# EAGLE design uplink (EAGLE 8.6.3)
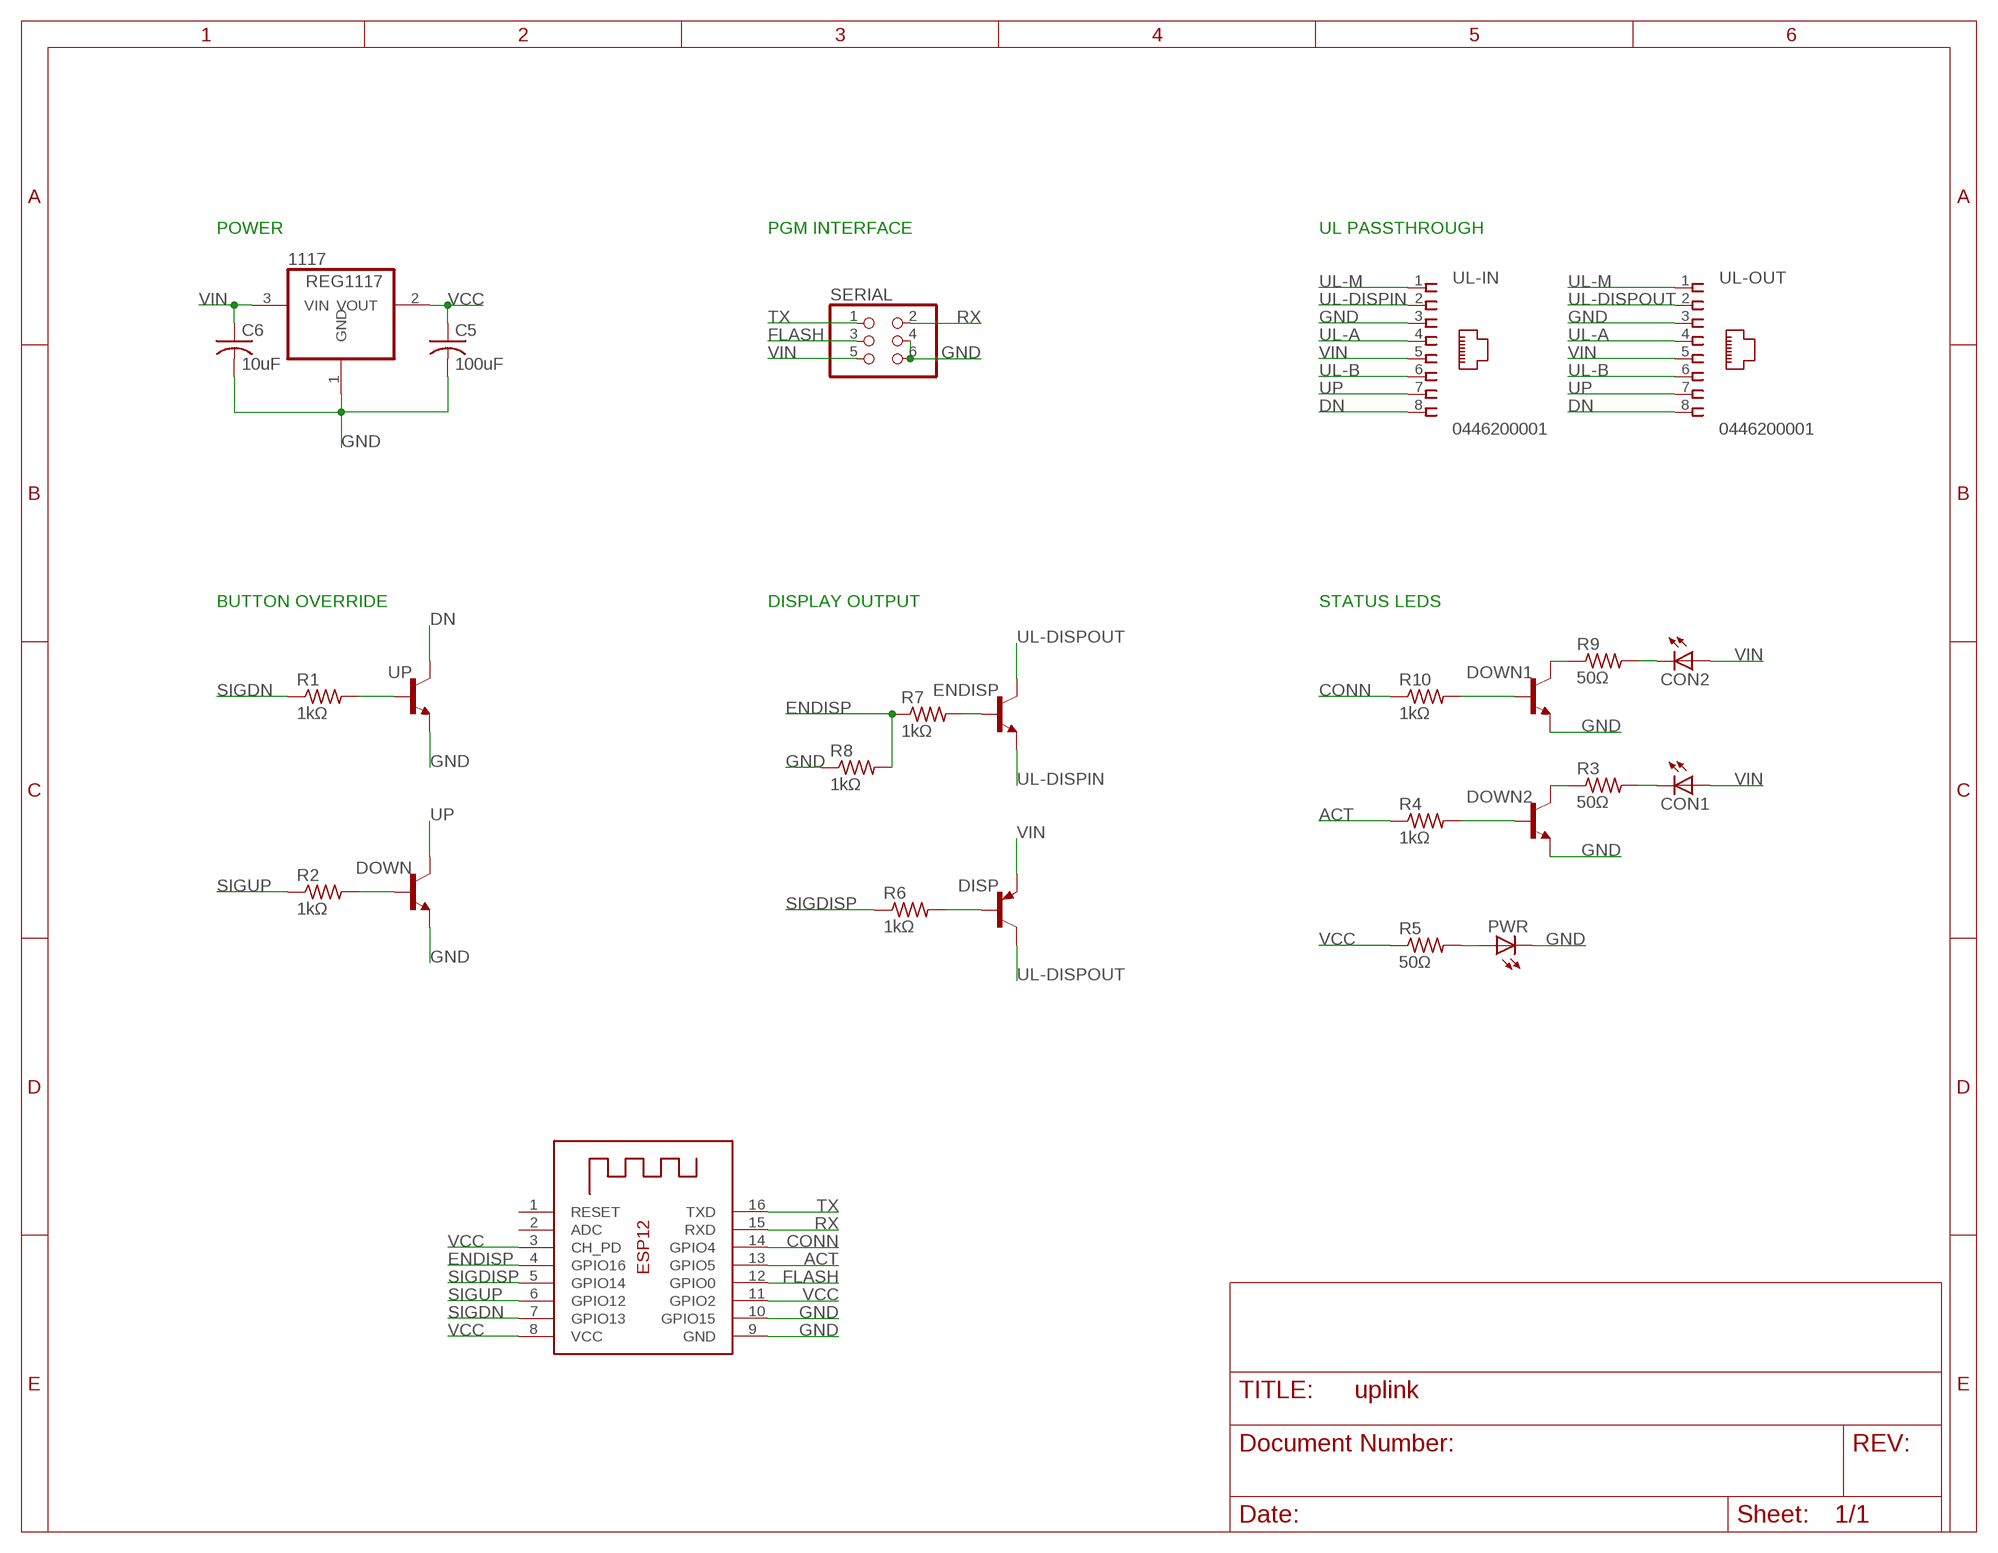
[diagram p0: schematic, sheet 1]

## Parts
1117  REG1117  [SOT223]
C5  100uF  C-USC0805  [C0805]
C6  10uF  C-USC0805  [C0805]
CON1  LEDCHIPLED_0805  [CHIPLED_0805]
CON2  LEDCHIPLED_0805  [CHIPLED_0805]
DISP  MMBT3906LT1SMD  [SOT23-BEC]
DOWN  MMBT3904LT1-NPN-SOT23-BEC  [SOT23-BEC]
DOWN1  MMBT3904LT1-NPN-SOT23-BEC  [SOT23-BEC]
DOWN2  MMBT3904LT1-NPN-SOT23-BEC  [SOT23-BEC]
ENDISP  MMBT3904LT1-NPN-SOT23-BEC  [SOT23-BEC]
ESP12  ESP-12  [ESP-12]
PWR  LEDCHIPLED_0805  [CHIPLED_0805]
R1  1kΩ  R-US_M0805  [M0805]
R2  1kΩ  R-US_M0805  [M0805]
R3  50Ω  R-US_M0805  [M0805]
R4  1kΩ  R-US_M0805  [M0805]
R5  50Ω  R-US_M0805  [M0805]
R6  1kΩ  R-US_M0805  [M0805]
R7  1kΩ  R-US_M0805  [M0805]
R8  1kΩ  R-US_M0805  [M0805]
R9  50Ω  R-US_M0805  [M0805]
R10  1kΩ  R-US_M0805  [M0805]
SERIAL  PINHD-2X3  [2X03]
UL-IN  0446200001  [0446200001]
UL-OUT  0446200001  [0446200001]
UP  MMBT3904LT1-NPN-SOT23-BEC  [SOT23-BEC]

## Nets
ACT: ESP12.13(GPIO5) R4.1
CONN: ESP12.14(GPIO4) R10.1
DN: UL-IN.8 UL-OUT.8 UP.C
ENDISP: ESP12.4(GPIO16) R7.1 R8.2
FLASH: ESP12.12(GPIO0) SERIAL.3
GND: 1117.1(GND) C5.2 C6.2 DOWN1.E DOWN2.E DOWN.E ESP12.9(GND) ESP12.10(GPIO15) PWR.C R8.1 SERIAL.4 SERIAL.6 UL-IN.3 UL-OUT.3 UP.E
N$1: R1.2 UP.B
N$2: DOWN.B R2.2
N$3: DISP.B R6.2
N$4: ENDISP.B R7.2
N$5: CON2.C R9.2
N$6: DOWN1.C R9.1
N$7: DOWN1.B R10.2
N$8: PWR.A R5.2
N$9: DOWN2.C R3.1
N$10: DOWN2.B R4.2
N$11: CON1.C R3.2
RX: ESP12.15(RXD) SERIAL.2
SIGDISP: ESP12.5(GPIO14) R6.1
SIGDN: ESP12.7(GPIO13) R1.1
SIGUP: ESP12.6(GPIO12) R2.1
TX: ESP12.16(TXD) SERIAL.1
UL-A: UL-IN.4 UL-OUT.4
UL-B: UL-IN.6 UL-OUT.6
UL-DISPIN: ENDISP.E UL-IN.2
UL-DISPOUT: DISP.C ENDISP.C UL-OUT.2
UL-M: UL-IN.1 UL-OUT.1
UP: DOWN.C UL-IN.7 UL-OUT.7
VCC: 1117.2(VOUT) C5.1 ESP12.3(CH_PD) ESP12.8(VCC) ESP12.11(GPIO2) R5.1
VIN: 1117.3(VIN) C6.1 CON1.A CON2.A DISP.E SERIAL.5 UL-IN.5 UL-OUT.5
Unconnected: ESP12.1(RESET) ESP12.2(ADC)

## Notes on the sheet
- POWER | PGM INTERFACE | UL PASSTHROUGH
- BUTTON OVERRIDE | DISPLAY OUTPUT | STATUS LEDS

## Library data of the parts
1117 = burr-brown:REG1117: 800mA and 1A Low Dropout (LDO) Positive Regulator 1.8V, 2.5V, 2.85V, 3.3V, 5V, and Adj; MPN: REG1117; OC_FARNELL: 1097566; OC_NEWARK: 14P6981
C5 C6 = rcl:C-US: CAPACITOR, American symbol; SPICEPREFIX: C
CON1 CON2 PWR = adafruit:LED: LED OSRAM: - CHIPLED LG R971, LG N971, LY N971, LG Q971, LY Q971, LO R971, LY R971 LH N974, LH R974 LS Q976, LO Q976, LY Q976 LO Q996 - Hyper CHIPLED LW Q18S LB Q993, LB Q99A, LB R99A - SideLED LS A670, LO A670, LY A670, LG A670, LP A670 LB A673, LV A673, LT A673, LW A673 LH A674 LY A675 LS A676, LA A676, LO A676, LY A676, LW A676 LS A679, LY A679, LG A679 - Hyper Micro SIDELED® LS Y876, LA Y876, LO Y876, LY Y876 LT Y87S - SmartLED LW L88C, LW L88S LB L89C, LB L89S, LG L890 LS L89K, LO L89K, LY L89K LS L896, LA L896, LO L896, LY L896 - TOPLED LS T670, LO T670, LY T670, LG T670, LP T670 LSG T670, LSP T670, LSY T670, LOP T670, LYG T670 LG T671, LOG T671, LSG T671 LB T673, LV T673, LT T673, LW T673 LH T674 LS T676, LA T676, LO T676, LY T676, LB T676, LH T676, LSB T676, LW T676 LB T67C, LV T67C, LT T67C, LS T67K, LO T67K, LY T67K, LW E67C LS E67B, LA E67B, LO E67B, LY E67B, LB E67C, LV E67C, LT E67C LW T67C LS T679, LY T679, LG T679 LS T770, LO T770, LY T770, LG T770, LP T770 LB T773, LV T773, LT T773, LW T773 LH T774 LS E675, LA E675, LY E675, LS T675 LS T776, LA T776, LO T776, LY T776, LB T776 LHGB T686 LT T68C, LB T68C - Hyper Mini TOPLED® LB M676 - Mini TOPLED Santana® LG M470 LS M47K, LO M47K, LY M47K Source: http://www.osram.convergy.de/
DISP = transistor-pnp:MMBT3906*: PNP Transistror
DOWN DOWN1 DOWN2 ENDISP UP = transistor-neu-to92:*-NPN-: NPN Transistror
ESP12 = adafruit:ESP-12
R1-R10 = adafruit:R-US_: RESISTOR, American symbol
SERIAL = pinhead:PINHD-2X3: PIN HEADER
UL-IN UL-OUT = con-molex:0446200001: RJ-45 INVERTED MODULAR JACK ASSEMBLY WITH RJ-11 KEEPOUT FEATURE Source: Data sheet <http://www.farnell.com/datasheets/73207.pdf>; MF: MOLEX; OC_FARNELL: unknown

## Module POWER
Ports: 

### Library data of the parts

## Board
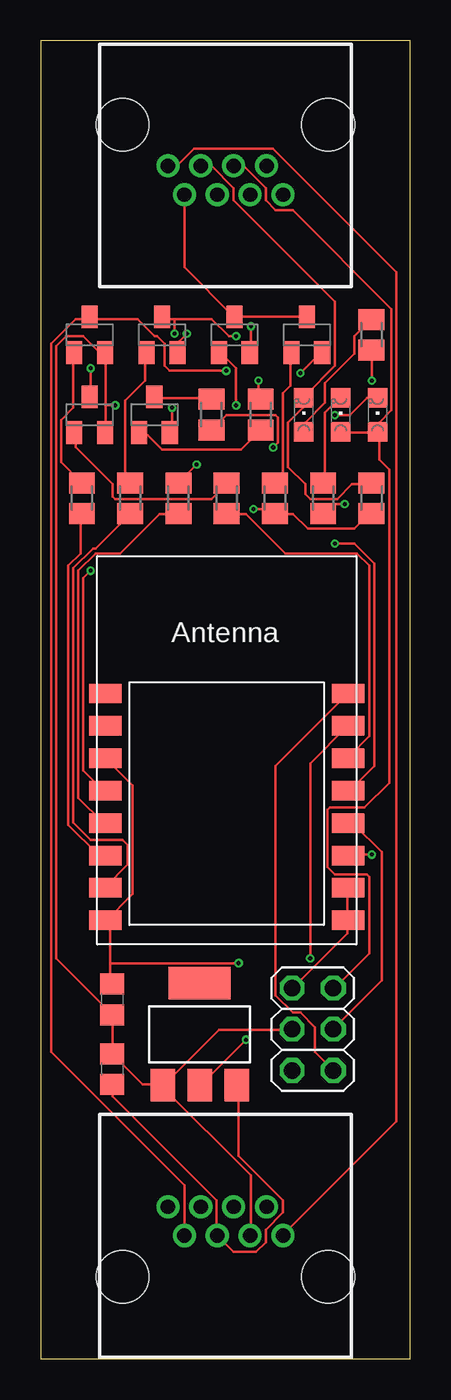
[diagram p1: board, top side]
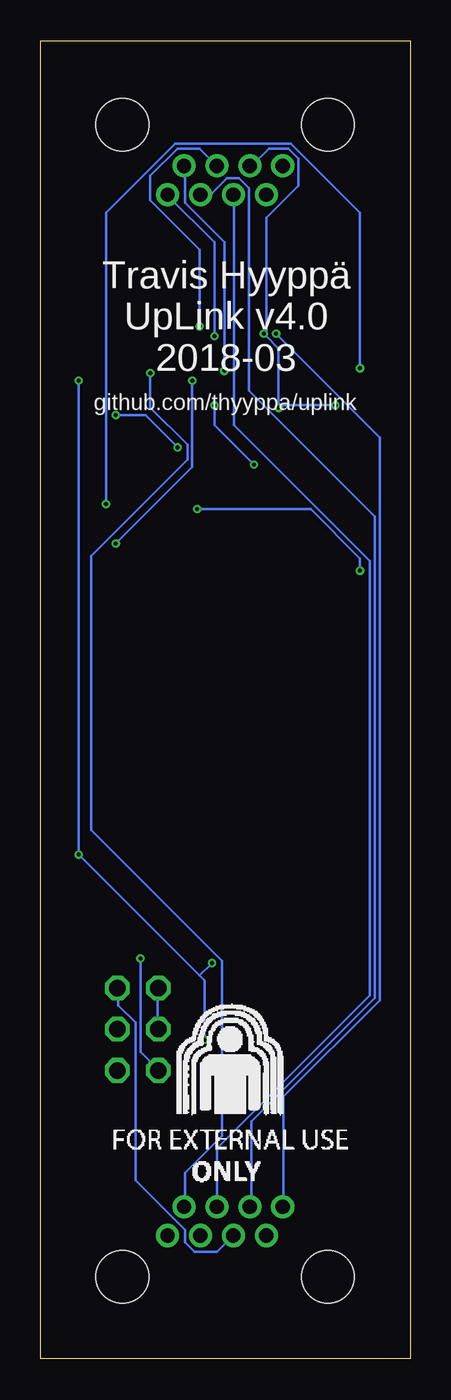
[diagram p2: board, bottom side, seen from below]

Size 22.84 x 81.4 mm. Coordinates in mm from the lower left corner, seen from the top.
Outline: 0,0 22.84,0 22.84,81.4 0,81.4 0,0
Copper layers (1*16): Top 0.035559375mm / dielectric 1.6mm / Bottom 0.035559375mm
Design rules "oshpark-2layer-novia": minimum track width 6mil, minimum drill 10mil, track to track 6mil, track to pad 6mil, pad to pad 6mil, via to via 6mil, smd to smd 6mil, copper to edge 15mil, drill to drill 6mil, minimum pad ring 5mil, minimum via ring 5mil, stop-mask expansion 2.5mil, vias tented up to drill 0.256540625mm, thermal gap 10mil

### Footprints (pad centres in the part's own frame; a part is rotated, then mirrored left to right if it is on the bottom)
SOT223 = smd 1.499 x 2.007: 1 -2.261,-3.15; 2 0.025,-3.15; 3 2.311,-3.15 | smd 3.81 x 2.007: 4 0,3.15
C0805 = smd 1.3 x 1.5: 1 -0.95,0; 2 0.95,0
CHIPLED_0805 = smd 1.2 x 1.2: A 0,-1.05; C 0,1.05
SOT23-BEC = smd 1 x 1.4: B -0.95,-1.1; C 0,1.1; E 0.95,-1.1
ESP-12 = smd 2 x 1.2: 1 -7.5,4.5; 2 -7.5,2.5; 3 -7.5,0.5; 4 -7.5,-1.5; 5 -7.5,-3.5; 6 -7.5,-5.5; 7 -7.5,-7.5; 8 -7.5,-9.5; 9 7.5,-9.5; 10 7.5,-7.5; 11 7.5,-5.5; 12 7.5,-3.5; 13 7.5,-1.5; 14 7.5,0.5; 15 7.5,2.5; 16 7.5,4.5
M0805 = smd 1.3 x 1.6: 1 -0.95,0; 2 0.95,0
2X03 = drill 1.016 octagon: 1 -2.54,-1.27; 2 -2.54,1.27; 3 0,-1.27; 4 0,1.27; 5 2.54,-1.27; 6 2.54,1.27
0446200001 = drill 0.889 pad 1.422: 1 3.556,2.54; 2 2.54,4.318; 3 1.524,2.54; 4 0.508,4.318; 5 -0.508,2.54; 6 -1.524,4.318; 7 -2.54,2.54; 8 -3.556,4.318 | hole 3.251: 6.35,0; -6.35,0

### Placement (x,y rotation side)
1117  9.82,20.05 0 top
C5  4.43,22.2 270 top
C6  4.43,17.89 90 top
CON1  20.83,58.3 0 top
CON2  18.55,58.3 0 top
DISP  11.98,63.23 0 top
DOWN  3.04,63.23 0 top
DOWN1  3.04,58.3 0 top
DOWN2  7.04,58.3 0 top
ENDISP  16.45,63.23 0 top
ESP12  11.51,36.59 0 top
PWR  16.27,58.3 0 top
R1  5.54,53.14 90 top
R2  2.56,53.14 90 top
R3  10.56,58.3 270 top
R4  13.61,58.3 270 top
R5  20.45,63.23 90 top
R6  8.52,53.14 90 top
R7  14.49,53.14 90 top
R8  20.45,53.14 270 top
R9  17.47,53.14 90 top
R10  11.5,53.14 90 top
SERIAL  16.82,20.36 90 top
UL-IN  11.43,5.08 0 top
UL-OUT  11.43,76.2 180 top
UP  7.51,63.23 0 top

### Tracks (layer width: path | path; a pad name or v marks a point on that pad's centre or on a via)
ACT  (via drill 0.25)
  Top 0.152: v13.46,60.4 13.46,59.33 R4.1 | v18.19,50.34 19.41,50.34 20.62,49.12 20.62,36.63 19.1,35.1 ESP12.13
  Bottom 0.152: v13.46,60.4 13.46,55.07 v18.19,50.34
CONN
  Top 0.152: R10.1 11.63,52.17 12.7,52.17 15.14,49.73 19.56,49.73 20.32,48.97 20.32,38.46 19.1,37.24 ESP12.14
DN  (via drill 0.25)
  Top 0.152: 8.28,64.21 10.57,64.21 11.63,63.14 v12.09,63.14 | 8.28,64.21 7.52,64.21 UP.C | 8.28,64.21 v8.28,63.3
  Bottom 0.152: v12.09,63.14 12.09,68.94 14.99,71.83 UL-OUT.8 | v8.28,63.3 1.88,56.9 1.88,22.15 7.82,16.21 7.82,9.5 UL-IN.8
ENDISP  (via drill 0.25)
  Top 0.152: R8.2 20.32,52.17 19.41,51.26 16.51,51.26 15.6,52.17 14.53,52.17 R7.1 14.38,52.32 14.22,52.48 v13.16,52.48 | v3.1,48.67 2.64,48.21 2.64,36.32 3.86,35.1 ESP12.4
  Bottom 0.152: v3.1,48.67 3.1,49.43 6.15,52.48 v13.16,52.48
FLASH
  Top 0.152: ESP12.12 19.1,32.97 19.41,32.97 21.08,31.29 21.08,23.37 18.19,20.47 SERIAL.3
GND  (via drill 0.25)
  Top 0.152: R8.1 20.32,54 19.25,54 18.34,53.09 16.66,53.09 16.36,53.39 16.36,54 15.29,55.07 15.29,57.81 16.2,58.73 16.2,59.33 PWR.C 16.36,59.49 18.19,61.32 18.19,65.28 11.94,71.53 11.94,72.29 10.57,73.66 UL-OUT.3 | 4.01,58.88 4.01,62.08 DOWN.E 3.86,62.23 3.56,62.23 2.64,63.14 1.57,63.14 0.96,62.54 0.96,24.74 4.32,21.39 C5.2 4.47,21.23 4.47,18.95 C6.2 4.47,18.8 6.3,16.97 7.52,16.97 1117.1 | 4.01,58.88 4.01,57.2 DOWN1.E | v8.13,58.73 8.13,57.2 DOWN2.E | v9.04,63.3 8.58,62.84 8.58,62.23 UP.E | v4.62,58.88 4.01,58.88 | ESP12.10 18.95,29.01 18.95,27.18 ESP12.9 18.95,27.03 18.95,26.26 15.6,22.91 SERIAL.6 | UL-IN.3 13.01,7.67 13.01,11.33 7.52,16.82 1117.1 | SERIAL.4 15.44,20.32 11.02,20.32 7.67,16.97 1117.1
  Bottom 0.152: 8.13,58.88 8.13,62.38 8.89,63.14 8.89,63.3 | 8.89,63.3 8.89,70.46 6.91,72.44 6.91,74.12 7.52,74.73 8.74,74.73 9.8,73.66 UL-OUT.3 | 8.89,63.3 v9.04,63.3 | 8.13,58.88 v4.62,58.88 | 8.13,58.88 v8.13,58.73 | SERIAL.4 15.6,20.47 15.6,22.76 SERIAL.6
N$1
  Top 0.152: UP.B 6.45,62.08 6.45,60.4 5.23,59.18 5.23,54.46 5.54,54.15 R1.2
N$2
  Top 0.152: DOWN.B 2.03,62.08 2.03,58.73 1.27,57.96 1.27,55.37 2.49,54.15 R2.2
N$3  (via drill 0.25)
  Top 0.152: v12.09,58.88 12.09,61.16 11.18,62.08 DISP.B | v9.65,55.22 8.58,54.15 R6.2
  Bottom 0.152: v12.09,58.88 12.09,57.66 v9.65,55.22
N$4
  Top 0.152: ENDISP.B 15.44,62.08 15.44,60.1 14.99,59.64 14.99,54.61 14.53,54.15 R7.2
N$5
  Top 0.152: CON2.C 18.49,59.33 17.58,58.42 17.58,54.15 R9.2
N$6  (via drill 0.25)
  Top 0.152: v3.1,61.16 3.1,59.49 DOWN1.C | v18.8,52.78 18.03,52.78 17.58,52.32 R9.1
  Bottom 0.152: v3.1,61.16 3.1,70.76 7.37,75.03 14.53,75.03 18.8,70.76 v18.8,52.78
N$7
  Top 0.152: DOWN1.B 2.18,57.05 2.18,56.29 4.47,54 4.47,53.24 4.62,53.09 10.57,53.09 11.48,54 R10.2
N$8
  Top 0.152: PWR.A 16.36,57.35 16.36,57.81 17.58,59.03 17.58,60.25 19.41,62.08 19.41,63.14 20.32,64.06 R5.2
N$9
  Top 0.152: DOWN2.C 7.06,59.33 10.41,59.33 R3.1
N$10
  Top 0.152: DOWN2.B 6.15,57.05 6.6,57.05 7.52,56.13 12.39,56.13 13.46,57.2 R4.2
N$11  (via drill 0.25)
  Top 0.152: v18.19,58.27 19.1,58.27 20.17,59.33 20.78,59.33 CON1.C | v14.38,56.29 14.68,56.59 14.68,58.12 14.53,58.27 11.48,58.27 R3.2
  Bottom 0.152: v18.19,58.27 16.36,58.27 v14.38,56.29
RX  (via drill 0.25)
  Top 0.152: v16.66,24.74 16.66,36.78 18.95,39.06 ESP12.15
  Bottom 0.152: v16.66,24.74 16.66,18.95 15.6,17.88 SERIAL.2
SIGDISP
  Top 0.152: R6.1 8.43,52.17 7.37,52.17 4.93,49.73 3.4,49.73 2.34,48.67 2.34,34.65 3.86,33.12 ESP12.5
SIGDN
  Top 0.152: R1.1 5.54,52.17 3.4,50.04 3.25,50.04 2.03,48.82 2.03,33.12 3.1,32.05 5.08,32.05 5.38,31.75 5.38,30.53 4.01,29.16 ESP12.7
SIGUP
  Top 0.152: R2.1 2.49,52.17 2.49,49.73 1.73,48.97 1.73,32.97 3.56,31.14 3.86,31.14 ESP12.6
TX
  Top 0.152: ESP12.16 18.95,41.05 14.53,36.63 14.53,22.45 15.6,21.39 16.05,21.39 16.97,20.47 16.97,18.95 18.03,17.88 SERIAL.1
UL-A
  Bottom 0.152: UL-IN.4 11.94,13 2.49,22.45 2.49,49.28 10.87,57.66 10.87,71.83 UL-OUT.4
UL-B
  Bottom 0.152: UL-IN.6 9.8,9.5 9.8,14.68 2.18,22.3 2.18,52.02 9.96,59.79 9.96,72.29 10.57,72.9 11.33,72.9 12.24,71.98 12.85,71.98 UL-OUT.6
UL-DISPIN  (via drill 0.25)
  Top 0.152: v16.05,60.86 17.27,62.08 ENDISP.E
  Bottom 0.152: v16.05,60.86 16.05,58.73 13.77,56.44 13.77,55.52 19.71,49.58 19.71,32.66 11.63,24.59 11.63,13.77 13.92,11.48 13.92,9.5 UL-IN.2
UL-DISPOUT
  Top 0.152: ENDISP.C 16.36,64.36 12.09,64.36 DISP.C 11.94,64.36 8.89,67.41 UL-OUT.2
UL-M
  Top 0.152: UL-OUT.1 8.43,73.66 9.5,74.73 14.38,74.73 22,67.11 22,14.68 14.99,7.67 UL-IN.1
UP  (via drill 0.25)
  Top 0.152: v11.48,61.01 7.98,61.01 7.67,61.32 7.67,62.69 7.21,63.14 7.06,63.14 5.99,64.21 3.1,64.21 DOWN.C 2.95,64.21 2.18,64.21 0.66,62.69 0.66,18.95 8.89,10.72 UL-IN.7
  Bottom 0.152: v11.48,61.01 11.48,68.94 13.92,71.37 13.92,73.66 UL-OUT.7
VCC  (via drill 0.25)
  Top 0.152: 4.32,24.44 4.32,26.72 4.01,27.03 | 4.32,24.44 4.32,23.22 C5.1 | 4.01,27.03 5.69,28.7 5.69,35.41 ESP12.3 | 4.01,27.03 ESP12.8 | v20.47,60.4 20.47,62.23 R5.1 | v20.47,31.14 19.1,31.14 ESP12.11 | v12.7,19.71 9.96,16.97 1117.2 | v12.24,24.44 4.32,24.44
  Bottom 0.152: v20.47,60.4 v20.47,31.14 13.01,23.67 | v12.7,19.71 12.7,23.37 13.01,23.67 | 13.01,23.67 v12.24,24.44
VIN  (via drill 0.25)
  Top 0.152: CON2.A 18.64,57.2 20.78,57.2 CON1.A | v13.01,63.75 13.01,62.23 DISP.E | UL-OUT.5 12.55,73.66 13.92,72.29 13.92,71.53 14.53,70.92 15.6,70.92 21.69,64.82 21.69,58.57 20.93,57.81 20.93,57.35 CON1.A | C6.1 4.47,16.82 4.47,16.21 10.87,9.8 10.87,7.67 UL-IN.5 11.94,6.6 13.31,6.6 13.92,7.21 13.92,7.98 14.99,9.04 14.99,9.8 12.24,12.55 12.24,16.82 1117.3 | CON1.A 20.93,57.2 20.93,55.52 21.54,54.91 21.54,35.56 20.02,34.04 17.88,34.04 17.73,33.88 17.73,30.38 18.19,29.92 20.17,29.92 20.32,29.77 20.32,25.04 18.19,22.91 SERIAL.5
  Bottom 0.152: v13.01,63.75 13.01,68.48 16.05,71.53 16.05,73.05 14.38,74.73 13.01,74.73 UL-OUT.5 | UL-IN.5 11.94,6.6 13.31,6.6 13.92,7.21 13.92,7.98 16.97,11.02 16.97,20.78 18.03,21.84 18.03,22.76 SERIAL.5

### Text on the board
bPlace: Travis Hyyppä / UpLink v4.0 / 2018-03 | github.com/thyyppa/uplink